# Altium schematic sheet rj45_breakout.SchDoc
size A
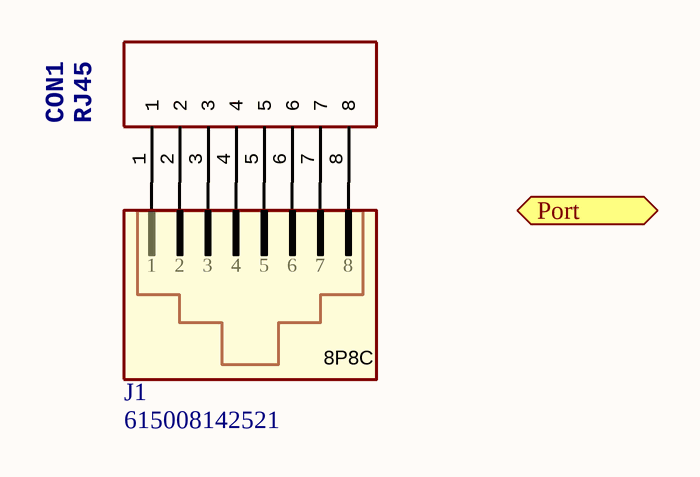
[diagram p0: rj45_breakout.SchDoc]

## Parts
CON1  RJ45  [RJ45-CHASSISCONNECTOR]
J1  615008142521  [615008142521]

## Ports
Port

## Nets
NetCON1_1: CON1.1 J1.1
NetCON1_2: CON1.2 J1.2
NetCON1_3: CON1.3 J1.3
NetCON1_4: CON1.4 J1.4
NetCON1_5: CON1.5 J1.5
NetCON1_6: CON1.6 J1.6
NetCON1_7: CON1.7 J1.7
NetCON1_8: CON1.8 J1.8

## Library data of the parts
CON1 = RJ45-TOP: Part_Group_Name: connector; Placement_Type: 1; Part Number: RJ45-TOP
J1 = 615008142521: Part_Group_Name: connector; PinNumber: 8P8C; Placement_Type: 4; PublishedDate: July 2016; Publisher: Wurth Elektronik; ComponentLink1Description: Manufacturer; ComponentLink1URL: http://www.we-online.de; ComponentLink2Description: Datasheet; ComponentLink2URL: http://katalog.we-online.de/em/datasheet/615008142521.pdf; PartNumber: 615008142521; Part Number: 615008142521